# Altium schematic sheet MCU.SchDoc
size A4; SheetNumber: 2; SheetTotal: 5
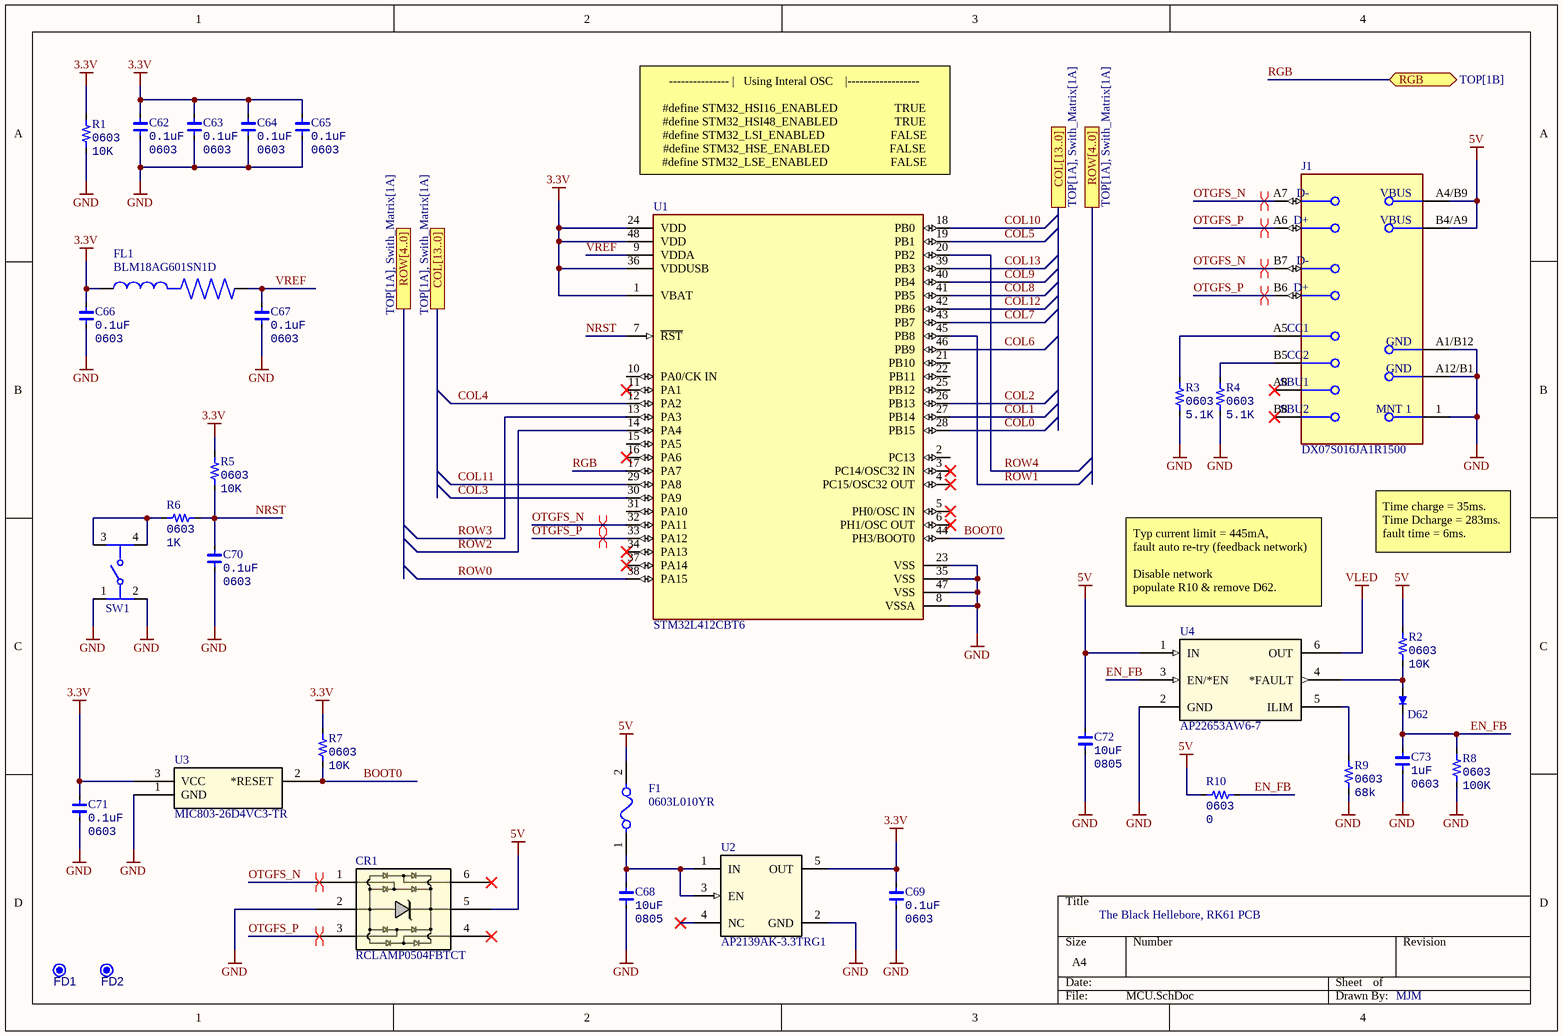
[diagram p0: MCU.SchDoc]

## Parts
C62  value 0.1uF  Type: 0603  [FP-CC0603-DA-MFG]  (hidden comment: CC0603JRX7R9BB104)
C63  value 0.1uF  Type: 0603  [FP-CC0603-DA-MFG]  (hidden comment: CC0603JRX7R9BB104)
C64  value 0.1uF  Type: 0603  [FP-CC0603-DA-MFG]  (hidden comment: CC0603JRX7R9BB104)
C65  value 0.1uF  Type: 0603  [FP-CC0603-DA-MFG]  (hidden comment: CC0603JRX7R9BB104)
C66  value 0.1uF  Type: 0603  [FP-CC0603-DA-MFG]  (hidden comment: CC0603JRX7R9BB104)
C67  value 0.1uF  Type: 0603  [FP-CC0603-DA-MFG]  (hidden comment: CC0603JRX7R9BB104)
C68  value 10uF  Type: 0805  [FP-GRM21B-0_15-MFG]  (hidden comment: GRM21BR71A106KA73K)
C69  value 0.1uF  Type: 0603  [FP-CC0603-DA-MFG]  (hidden comment: CC0603JRX7R9BB104)
C70  value 0.1uF  Type: 0603  [FP-CC0603-DA-MFG]  (hidden comment: CC0603JRX7R9BB104)
C71  value 0.1uF  Type: 0603  [FP-CC0603-DA-MFG]  (hidden comment: CC0603JRX7R9BB104)
C72  value 10uF  Type: 0805  [FP-GRM21B-0_15-MFG]  (hidden comment: GRM21BR71A106KA73K)
C73  value 1uF  Type: 0603  [FP-CC0603-DA-MFG]  (hidden comment: CC0603JRX7R7BB105)
CR1  RCLAMP0504FBTCT  [SC70_RCLAMP_SEM]
D62  RB520S30T5G  [ONSC-SOD-523-2-502-01_V]  (value not drawn)
F1  0603L010YR  [FP-0603L-MFG]
FD1  FIDUCIAL  [FID1X2R]  (value not drawn)  (no BOM)
FD2  FIDUCIAL  [FID1X2R]  (value not drawn)  (no BOM)
FL1  BLM18AG601SN1D  [BEADC1608X95N]
J1  DX07S016JA1R1500  [FP-DX07S016JA1R1500-MFG]
R1  value 10K  Type: 0603  [FP-RMCF0603-MFG]  (hidden comment: RMCF0603JT10K0)
R2  value 10K  Type: 0603  [FP-RMCF0603-MFG]  (hidden comment: RMCF0603JT10K0)
R3  value 5.1K  Type: 0603  [FP-RMCF0603-MFG]  (hidden comment: RMCF0603JT5K10)
R4  value 5.1K  Type: 0603  [FP-RMCF0603-MFG]  (hidden comment: RMCF0603JT5K10)
R5  value 10K  Type: 0603  [FP-RMCF0603-MFG]  (hidden comment: RMCF0603JT10K0)
R6  value 1K  Type: 0603  [FP-RMCF0603-MFG]  (hidden comment: RMCF0603JT1K00)
R7  value 10K  Type: 0603  [FP-RMCF0603-MFG]  (hidden comment: RMCF0603JT10K0)
R8  value 100K  Type: 0603  [FP-RMCF0603-MFG]  (hidden comment: RMCF0603JT100K)
R9  value 68k  Type: 0603  [FP-RMCF0603-MFG]  (hidden comment: RMCF0603FT68K0)
R10  value 0  Type: 0603  [FP-RMCF0603-MFG]  (hidden comment: RMCF0603ZT0R00)
SW1  PTS526SK15SMTR2LFS  [FP-PTS526SK15SMTR2LFS-MFG]  (value not drawn)
U1  STM32L412CBT6  [FP-LQFP48-5B-MFG]
U2  AP2139AK-3.3TRG1  [DBV0005A-IPC_A]
U3  MIC803-26D4VC3-TR  [SC-70_C3_MCH]
U4  AP22653AW6-7  [SOT26-A1_DIO]

## Ports
COL[13..0] (see TOP[1A], Swith_Matrix[1A]), RGB (bidir, see TOP[1B]), ROW[4..0] (see TOP[1A], Swith_Matrix[1A])

## Nets
3.3V: C62.2 C63.2 C64.2 C65.2 C66.2 C69.2 C71.2 FL1.1 R1.2 R5.2 R7.2 U1.1(VBAT) U1.24(VDD) U1.36(VDDUSB) U1.48(VDD) U2.5(OUT) U3.3(VCC)
5V: C72.2 CR1.5 F1.2 J1.A4/B9(VBUS) J1.B4/A9(VBUS) R2.2 R10.1 U4.1(IN)
GND: C62.1 C63.1 C64.1 C65.1 C66.1 C67.1 C68.1 C69.1 C70.1 C71.1 C72.1 C73.1 CR1.2 J1.1(MNT_1) J1.A1/B12(GND) J1.A12/B1(GND) R1.1 R3.1 R4.1 R8.1 R9.1 SW1.1 SW1.2 U1.8(VSSA) U1.23(VSS) U1.35(VSS) U1.47(VSS) U2.2(GND) U3.1(GND) U4.2(GND)
VLED: U4.6(OUT)
BOOT0: R7.1 U1.44(PH3/BOOT0) U3.2(*RESET)
COL0: U1.28(PB15)
COL1: U1.27(PB14)
COL2: U1.26(PB13)
COL3: U1.30(PA9)
COL4: U1.12(PA2)
COL5: U1.19(PB1)
COL6: U1.46(PB9)
COL7: U1.43(PB7)
COL8: U1.41(PB5)
COL9: U1.40(PB4)
COL10: U1.18(PB0)
COL11: U1.29(PA8)
COL12: U1.42(PB6)
COL13: U1.39(PB3)
EN_FB: C73.2 D62.1(K) R8.2 R10.2 U4.3(EN/*EN)
NRST: C70.2 R5.1 R6.1 U1.7(~{RST})
OTGFS_N: CR1.1 J1.A7(D-) J1.B7(D-) U1.32(PA11)
OTGFS_P: CR1.3 J1.A6(D+) J1.B6(D+) U1.33(PA12)
RGB: U1.17(PA7) ; port RGB
ROW0: U1.38(PA15)
ROW1: U1.45(PB8)
ROW2: U1.14(PA4)
ROW3: U1.13(PA3)
ROW4: U1.20(PB2)
VREF: C67.2 FL1.2 U1.9(VDDA)
NetC68_2: C68.2 F1.1 U2.1(IN) U2.3(EN)
NetD62_2: D62.2(A) R2.1 U4.4(*FAULT)
NetJ1_A5: J1.A5(CC1) R3.2
NetJ1_B5: J1.B5(CC2) R4.2
NetR6_2: R6.2 SW1.3 SW1.4
NetR9_2: R9.2 U4.5(ILIM)

Not connected (* = marked no-connect by the designer): CR1 4* 6*; J1 A8(SBU1)* B8(SBU2)*; U1 2(PC13) 3(PC14/OSC32_IN)* 4(PC15/OSC32_OUT)* 5(PH0/OSC_IN)* 6(PH1/OSC_OUT)* 10(PA0/CK_IN) 11(PA1)* 15(PA5) 16(PA6)* 21(PB10) 22(PB11) 25(PB12) 31(PA10) 34(PA13)* 37(PA14)*; U2 4(NC)*

## Layout directives
differential pair: OTGFS_N, OTGFS_P

## Notes on the sheet
- --------------- |   Using Interal OSC    |------------------
  #define STM32_HSI16_ENABLED                   TRUE
  #define STM32_HSI48_ENABLED                   TRUE
  #define STM32_LSI_ENABLED                      FALSE
  #define STM32_HSE_ENABLED                    FALSE
  #define STM32_LSE_ENABLED                     FALSE
- Time charge = 35ms.
  Time Dcharge = 283ms.
  fault time = 6ms.
- (near U4) Typ current limit = 445mA,
  fault auto re-try (feedback network)
  Disable network
  populate R10 & remove D62.
- The Black Hellebore, RK61 PCB
- MJM

## Library data of the parts
C62-C67 C69-C71 = CMP-004-000009-6: 0603 0.1 uF 50 V ±5 % Tolerance X7R SMT Multilayer Ceramic Capacitor
C68 C72 = CMP-004-000013-3: Cap Ceramic 10uF 10V X7R 10% Pad SMD 0805 125C T/R
C73 = CMP-004-000010-4: Cap Ceramic 1uF 16V X7R 5% SMD 0603 125°C Paper T/R
CR1 = CMP-138-000000-2: ESD Suppressor TVS Quad Uni-Dir 30kV 6-Pin SC-70 T/R; Mfr_Name: Semtech; Type: DEV; Copyright: Copyright (C) 2022 Ultra Librarian. All rights reserved.; Pin Count: 6; Component Type: Standard; RefDes: RefDes; Digi-Key_Part_Number_1: RCLAMP0504FBTCTTR-ND; Design Item ID: RCLAMP0504FBTCT; Source: RCLAMP0504FBTCT.SchLib; Manufacturer_Part_Number: RCLAMP0504FBTCT; Digi-Key_Part_Number_3: RCLAMP0504FBTCTDKR-ND; Digi-Key_Part_Number_2: RCLAMP0504FBTCTCT-ND
D62 = CMP-070-000008-4: RB520S30T5G - 30 V 200 mA Surface Mount Schottky Diode - SOD-523
F1 = CMP-096-000003-1: 15VDC 100mA
FD1 FD2 = CMP-00028-00007-4: Fiducial - Round 1x2mm; Pins: 0
FL1 = CMP-032-000000-2: 600 Ohms @ 100MHz 1 Ferrite Bead 0603 _1608 Metric_ 500mA 380mOhm; Manufacturer: Murata; value: 600 Ohm; Design Item ID: BLM18AG601SN1D; Digi-Key_Part_Number: 490-1014-1-ND; Component Type: Standard; Package: 0608; Manufacturer Product Number: BLM18AG601SN1D; Pin Count: 2; Source: SnapEDAsch.SchLib
J1 = CMP-042-000007-2: Connector, USB Type C Receptacle, 1500 piece reel, 16 Pin Version
R1 R2 R5 R7 = CMP-012-000009-4: Res Thick Film 0603 10K Ohm 5% 1/10W ±100ppm/°C Molded SMD SMD Paper T/R
R3 R4 = CMP-012-000000-2: Res Thick Film 0603 5.1K Ohm 5% 1/10W ±200ppm/°C Molded SMD Paper T/R
R6 = CMP-000007-3: Res Thick Film 0603 1K Ohm 5% 1/10W ±200ppm/°C Molded SMD Paper T/R
R8 = CMP-000004-8: Res Thick Film 0603 100K Ohm 5% 1/10W ±200ppm/°C Molded SMD Paper T/R
R9 = CMP-012-000019-2: Res Thick Film 0603 68K Ohm 1% 0.1W(1/10W) ±100ppm/C Pad SMD Automotive T/R
R10 = CMP-000006-5: Res Thick Film 0603 0 Ohm Jumper 1/10W 100Ppm/ C Smd Rohs Compliant: Yes
SW1 = CMP-014-000000-1: Switch Tactile N.O. SPST Round Button Gull Wing 0.05A 12VDC 200000Cycles 2.55N SMD T/R
U1 = CMP-148-000005-1: STMICROELECTRONICS - STM32L412CBT6 - ARM MCU, STM32 Family STM32L4 Series Microcontrollers, ARM Cortex-M4, 32bitu, 80 MHz, 128 KB, 40 KB
U2 = CMP-140-000002-1: IC REG LDO 3.3V 0.25A SOT25; Component Type: Standard; RefDes: RefDes; Type: DEV; Pin Count: 5
U3 = CMP-136-000000-2: 3-Pin Microprocessor Supervisor Circuit w/ Open-Drain Reset Output; Mfr_Name: Microchip; Digi-Key_Part_Number_2: 576-3799-1-ND; Type: Simple Reset/Power-On Reset; Digi-Key_Part_Number_4: 576-3799-6-ND; Pin Count: 3; Component Type: Standard; Source: MIC803-26D4VC3-TR.SchLib; Copyright: Copyright (C) 2022 Ultra Librarian. All rights reserved.; Digi-Key_Part_Number_1: 1611-MIC803-26D4VC3-CT-ND; Design Item ID: MIC803-26D4VC3-TR; Digi-Key_Part_Number_3: 576-3799-2-ND; RefDes: RefDes; Manufacturer_Part_Number: MIC803-26D4VC3-TR
U4 = CMP-148-000002-2: PRECISION ADJUSTABLE CURRENT-LIMITED POWER SWITCHES, -40 to 85°C pF, RoHS; Mfr_Name: Diodes Inc; Component Type: Standard; Copyright: Copyright (C) 2022 Ultra Librarian. All rights reserved.; Source: AP22652AW6-7.SchLib; Manufacturer_Part_Number: AP22653AW6-7; Design Item ID: AP22653AW6-7; Pin Count: 6; Type: DEV; RefDes: RefDes